# Altium schematic sheet Sensors on Main Board.SchDoc: Accelerometer and Gyro on Main Controller
size Letter
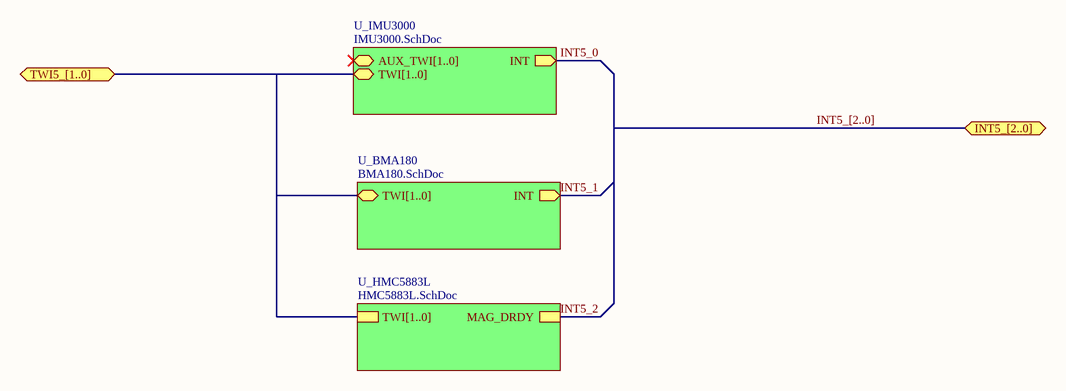
[diagram p0: Sensors on Main Board.SchDoc]

## Sub-sheets
U_BMA180 = BMA180.SchDoc: INT (out), TWI[1..0] (bidir)
U_HMC5883L = HMC5883L.SchDoc: TWI[1..0], MAG_DRDY
U_IMU3000 = IMU3000.SchDoc: INT (out), AUX_TWI[1..0] (bidir), TWI[1..0] (bidir)

## Ports
INT5_[2..0], TWI5_[1..0]

## Nets
INT5_0: sheet U_IMU3000/INT
INT5_1: sheet U_BMA180/INT
INT5_2: sheet U_HMC5883L/MAG_DRDY

## Buses and harness runs
bus INT5_[2..0] = port INT5_[2..0]
bus port TWI5_[1..0] = sheet U_BMA180/TWI[1..0] = sheet U_HMC5883L/TWI[1..0] = sheet U_IMU3000/TWI[1..0]

## Notes on the sheet
- Title
- Size:
- Date:
- Letter
- Number:
- Time:
- Revision:
- Sheet
- of
- File: